# Altium schematic sheet SIM800.SchDoc
size A
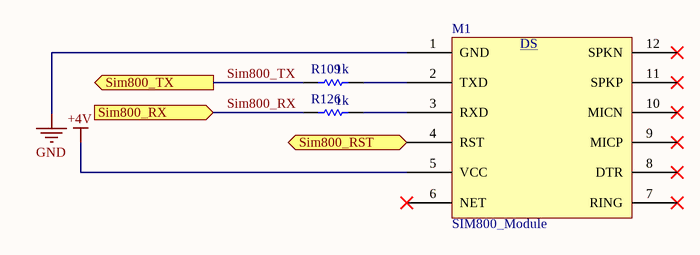
[diagram p0: SIM800.SchDoc]

## Parts
M1  SIM800_Module  [SIM800_Module]
R109  value 1k  [R-805]  (hidden comment: R-805)
R126  value 1k  [R-805]  (hidden comment: R-805)

## Ports
Sim800_RST (in), Sim800_RX (in), Sim800_TX (out)

## Nets
+4V: M1.5(VCC)
GND: M1.1(GND)
Sim800_RST: M1.4(RST) ; port Sim800_RST
Sim800_RX: R126.2 ; port Sim800_RX
Sim800_TX: R109.2 ; port Sim800_TX
NetM1_2: M1.2(TXD) R109.1
NetM1_3: M1.3(RXD) R126.1

Not connected (* = marked no-connect by the designer): M1 6(NET)* 7(RING)* 8(DTR)* 9(MICP)* 10(MICN)* 11(SPKP)* 12(SPKN)*

## Notes on the sheet
- (in symbol SIM800_Module) DS

## Library data of the parts
R109 R126 = R-805: Resistor